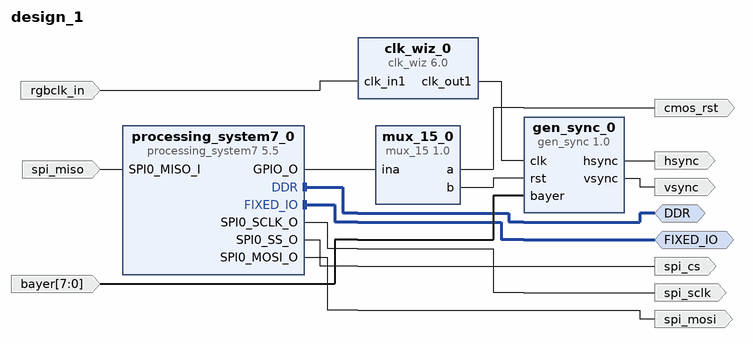
[diagram p0: block diagram of the top level]
# Vivado block design design_1, xc7z020clg400-1, Vivado 2018.3
create_bd_design design_1

create_bd_intf_port -mode Master -vlnv xilinx.com:interface:ddrx_rtl:1.0 DDR
create_bd_intf_port -mode Master -vlnv xilinx.com:display_processing_system7:fixedio_rtl:1.0 FIXED_IO
create_bd_port -dir O spi_sclk
create_bd_port -dir O spi_cs
create_bd_port -dir I spi_miso
create_bd_port -dir O spi_mosi
create_bd_port -dir O cmos_rst
create_bd_port -dir I -from 7 -to 0 bayer
create_bd_port -dir O vsync
create_bd_port -dir O hsync
create_bd_port -dir I -type clk rgbclk_in
set_property -dict {CONFIG.FREQ_HZ 74250000} [get_bd_ports rgbclk_in]

create_bd_cell -type ip -vlnv xilinx.com:ip:processing_system7:5.5 processing_system7_0
set_property -dict [list \
  CONFIG.PCW_EN_CLK0_PORT 0 \
  CONFIG.PCW_EN_RST0_PORT 0 \
  CONFIG.PCW_GPIO_EMIO_GPIO_ENABLE 1 \
  CONFIG.PCW_GPIO_EMIO_GPIO_IO 5 \
  CONFIG.PCW_GPIO_EMIO_GPIO_WIDTH 5 \
  CONFIG.PCW_PRESET_BANK1_VOLTAGE {LVCMOS 1.8V} \
  CONFIG.PCW_SD0_GRP_CD_ENABLE 0 \
  CONFIG.PCW_SD0_GRP_WP_ENABLE 0 \
  CONFIG.PCW_SD0_PERIPHERAL_ENABLE 1 \
  CONFIG.PCW_SD0_SD0_IO {MIO 40 .. 45} \
  CONFIG.PCW_SDIO_PERIPHERAL_FREQMHZ 100 \
  CONFIG.PCW_SPI0_PERIPHERAL_ENABLE 1 \
  CONFIG.PCW_SPI0_SPI0_IO EMIO \
  CONFIG.PCW_UART0_PERIPHERAL_ENABLE 1 \
  CONFIG.PCW_UART0_UART0_IO {MIO 46 .. 47} \
  CONFIG.PCW_UART_PERIPHERAL_FREQMHZ 100 \
  CONFIG.PCW_UIPARAM_DDR_PARTNO Custom \
  CONFIG.PCW_USE_M_AXI_GP0 0 \
] [get_bd_cells processing_system7_0]
# 80 more settings of processing_system7_0 are not shown: defaults, MIO pin electricals, DDR timing, and values the tool derives
create_bd_cell -type ip -vlnv xilinx.com:ip:clk_wiz:6.0 clk_wiz_0
set_property -dict [list \
  CONFIG.CLKIN1_JITTER_PS 134.68 \
  CONFIG.CLKOUT1_DRIVES BUFG \
  CONFIG.CLKOUT1_JITTER 154.367 \
  CONFIG.CLKOUT1_PHASE_ERROR 105.183 \
  CONFIG.CLKOUT1_REQUESTED_OUT_FREQ 74.25 \
  CONFIG.CLKOUT1_REQUESTED_PHASE 45 \
  CONFIG.CLKOUT2_DRIVES BUFG \
  CONFIG.CLKOUT3_DRIVES BUFG \
  CONFIG.CLKOUT4_DRIVES BUFG \
  CONFIG.CLKOUT5_DRIVES BUFG \
  CONFIG.CLKOUT6_DRIVES BUFG \
  CONFIG.CLKOUT7_DRIVES BUFG \
  CONFIG.FEEDBACK_SOURCE FDBK_AUTO \
  CONFIG.MMCM_CLKFBOUT_MULT_F 13.000 \
  CONFIG.MMCM_CLKIN1_PERIOD 13.468 \
  CONFIG.MMCM_CLKIN2_PERIOD 10.0 \
  CONFIG.MMCM_CLKOUT0_DIVIDE_F 13.000 \
  CONFIG.MMCM_CLKOUT0_PHASE 45.000 \
  CONFIG.MMCM_COMPENSATION ZHOLD \
  CONFIG.MMCM_DIVCLK_DIVIDE 1 \
  CONFIG.PRIMITIVE MMCM \
  CONFIG.PRIM_IN_FREQ 74.25 \
  CONFIG.USE_LOCKED false \
  CONFIG.USE_RESET false \
] [get_bd_cells clk_wiz_0]
create_bd_cell -type ip -vlnv xilinx.com:user:mux_15:1.0 mux_15_0
create_bd_cell -type ip -vlnv xilinx.com:user:gen_sync:1.0 gen_sync_0

# ---- connections ----

connect_bd_intf_net [get_bd_intf_ports DDR] [get_bd_intf_pins processing_system7_0/DDR]
connect_bd_intf_net [get_bd_intf_ports FIXED_IO] [get_bd_intf_pins processing_system7_0/FIXED_IO]
connect_bd_net [get_bd_pins processing_system7_0/SPI0_SCLK_O] [get_bd_ports spi_sclk]
connect_bd_net [get_bd_pins processing_system7_0/SPI0_SS_O] [get_bd_ports spi_cs]
connect_bd_net -net SPI0_MISO_I_0_1 [get_bd_ports spi_miso] [get_bd_pins processing_system7_0/SPI0_MISO_I]
connect_bd_net [get_bd_pins processing_system7_0/SPI0_MOSI_O] [get_bd_ports spi_mosi]
connect_bd_net [get_bd_ports rgbclk_in] [get_bd_pins clk_wiz_0/clk_in1]
connect_bd_net [get_bd_pins processing_system7_0/GPIO_O] [get_bd_pins mux_15_0/ina]
connect_bd_net [get_bd_pins mux_15_0/a] [get_bd_ports cmos_rst]
connect_bd_net [get_bd_pins clk_wiz_0/clk_out1] [get_bd_pins gen_sync_0/clk]
connect_bd_net [get_bd_pins gen_sync_0/vsync] [get_bd_ports vsync]
connect_bd_net [get_bd_pins gen_sync_0/hsync] [get_bd_ports hsync]
connect_bd_net [get_bd_ports bayer] [get_bd_pins gen_sync_0/bayer]
connect_bd_net [get_bd_pins mux_15_0/b] [get_bd_pins gen_sync_0/rst]

validate_bd_design
save_bd_design
